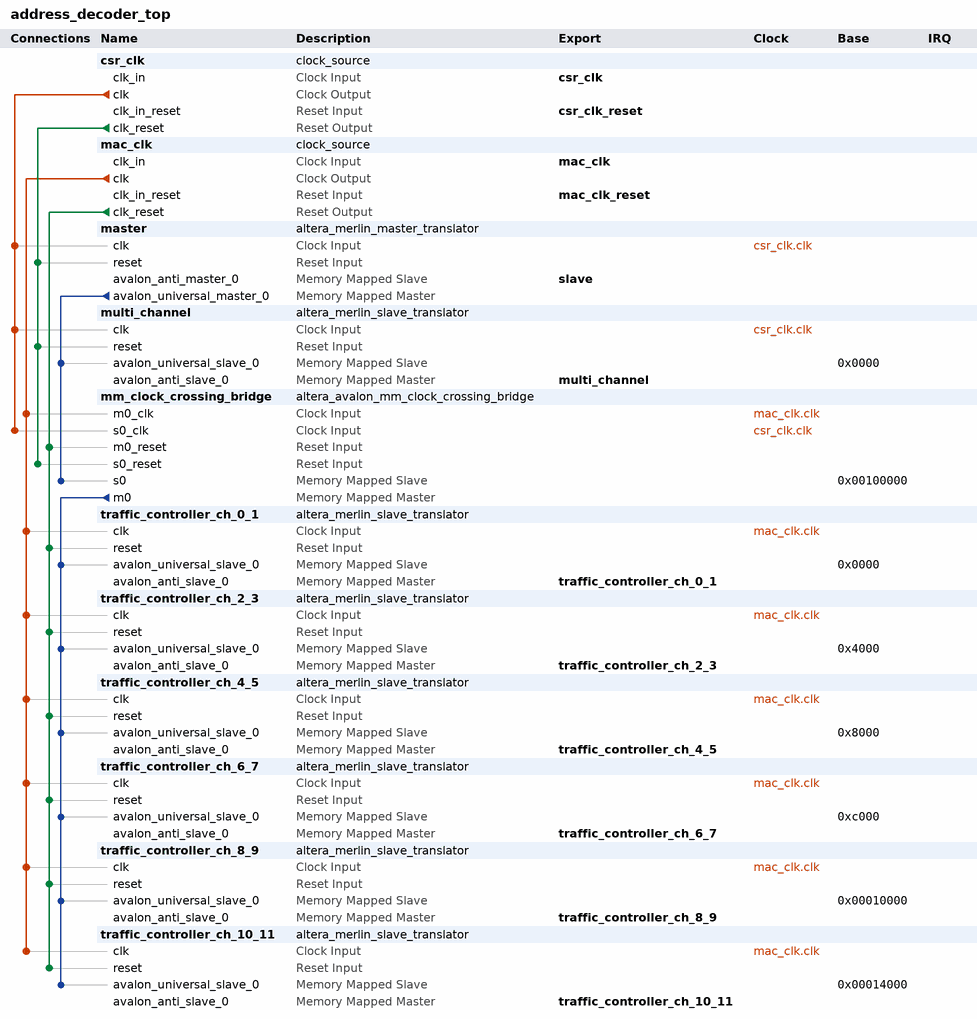
[diagram p0: system contents]
# Platform Designer (Qsys) system address_decoder_top, Cyclone 10 GX 10CX220YF780I5G
# Parameters at their usual value, and those the tool derives, are not listed.
package require -exact qsys 1.0
create_system address_decoder_top
set_project_property DEVICE_FAMILY {Cyclone 10 GX}
set_project_property DEVICE 10CX220YF780I5G

add_component csr_clk ip/address_decoder_top/address_decoder_top_csr_clk.ip clock_source csr_clk 0
load_component csr_clk
set_component_parameter_value clockFrequency 125000000
save_component

add_component mac_clk ip/address_decoder_top/address_decoder_top_mac_clk.ip clock_source mac_clk 
load_component mac_clk
set_component_parameter_value clockFrequency 156250000
save_component

add_component master ip/address_decoder_top/address_decoder_top_master.ip altera_merlin_master_translator master 18.0
load_component master
set_component_parameter_value AV_ADDRESS_W 26
set_component_parameter_value AV_DATA_W 32
set_component_parameter_value AV_BURSTCOUNT_W 3
set_component_parameter_value AV_BYTEENABLE_W 4
set_component_parameter_value UAV_ADDRESS_W 32
set_component_parameter_value UAV_BURSTCOUNT_W 3
set_component_parameter_value AV_READLATENCY 0
set_component_parameter_value AV_WRITE_WAIT 0
set_component_parameter_value AV_READ_WAIT 0
set_component_parameter_value AV_DATA_HOLD 0
set_component_parameter_value AV_SETUP_WAIT 0
set_component_parameter_value USE_READDATA 1
set_component_parameter_value USE_WRITEDATA 1
set_component_parameter_value USE_READ 1
set_component_parameter_value USE_WRITE 1
set_component_parameter_value USE_BEGINBURSTTRANSFER 0
set_component_parameter_value USE_BEGINTRANSFER 0
set_component_parameter_value USE_BYTEENABLE 0
set_component_parameter_value USE_CHIPSELECT 0
set_component_parameter_value USE_ADDRESS 1
set_component_parameter_value USE_BURSTCOUNT 0
set_component_parameter_value USE_DEBUGACCESS 0
set_component_parameter_value USE_CLKEN 0
set_component_parameter_value USE_READDATAVALID 1
set_component_parameter_value USE_WAITREQUEST 1
set_component_parameter_value USE_LOCK 0
set_component_parameter_value USE_READRESPONSE 0
set_component_parameter_value USE_WRITERESPONSE 0
set_component_parameter_value AV_SYMBOLS_PER_WORD 4
set_component_parameter_value AV_ADDRESS_SYMBOLS 1
set_component_parameter_value AV_BURSTCOUNT_SYMBOLS 1
set_component_parameter_value AV_CONSTANT_BURST_BEHAVIOR 0
set_component_parameter_value UAV_CONSTANT_BURST_BEHAVIOR 0
set_component_parameter_value AV_LINEWRAPBURSTS 0
set_component_parameter_value AV_MAX_PENDING_READ_TRANSACTIONS 1
set_component_parameter_value AV_BURSTBOUNDARIES 0
set_component_parameter_value AV_INTERLEAVEBURSTS 0
set_component_parameter_value AV_BITS_PER_SYMBOL 8
set_component_parameter_value AV_ISBIGENDIAN 0
set_component_parameter_value AV_ADDRESSGROUP 0
set_component_parameter_value UAV_ADDRESSGROUP 0
set_component_parameter_value AV_REGISTEROUTGOINGSIGNALS 0
set_component_parameter_value AV_REGISTERINCOMINGSIGNALS 0
set_component_parameter_value AV_ALWAYSBURSTMAXBURST 0
set_component_parameter_value SYNC_RESET 0
set_component_parameter_value WAITREQUEST_ALLOWANCE 0
save_component

add_component multi_channel ip/address_decoder_top/address_decoder_top_multi_channel.ip altera_merlin_slave_translator multi_channel 18.0
load_component multi_channel
set_component_parameter_value AV_ADDRESS_W 20
set_component_parameter_value AV_DATA_W 32
set_component_parameter_value UAV_DATA_W 32
set_component_parameter_value AV_BURSTCOUNT_W 1
set_component_parameter_value AV_BYTEENABLE_W 4
set_component_parameter_value UAV_BYTEENABLE_W 4
set_component_parameter_value UAV_ADDRESS_W 20
set_component_parameter_value UAV_BURSTCOUNT_W 3
set_component_parameter_value AV_READLATENCY 0
set_component_parameter_value AV_SETUP_WAIT 0
set_component_parameter_value AV_WRITE_WAIT 0
set_component_parameter_value AV_READ_WAIT 0
set_component_parameter_value AV_DATA_HOLD 0
set_component_parameter_value AV_TIMING_UNITS 1
set_component_parameter_value USE_READDATA 1
set_component_parameter_value USE_WRITEDATA 1
set_component_parameter_value USE_READ 1
set_component_parameter_value USE_WRITE 1
set_component_parameter_value USE_BEGINBURSTTRANSFER 0
set_component_parameter_value USE_BEGINTRANSFER 0
set_component_parameter_value USE_BYTEENABLE 0
set_component_parameter_value USE_CHIPSELECT 0
set_component_parameter_value USE_ADDRESS 1
set_component_parameter_value USE_BURSTCOUNT 0
set_component_parameter_value USE_READDATAVALID 0
set_component_parameter_value USE_WAITREQUEST 1
set_component_parameter_value USE_WRITEBYTEENABLE 0
set_component_parameter_value USE_LOCK 0
set_component_parameter_value USE_AV_CLKEN 0
set_component_parameter_value USE_UAV_CLKEN 0
set_component_parameter_value USE_OUTPUTENABLE 0
set_component_parameter_value USE_DEBUGACCESS 0
set_component_parameter_value USE_READRESPONSE 0
set_component_parameter_value USE_WRITERESPONSE 0
set_component_parameter_value AV_SYMBOLS_PER_WORD 4
set_component_parameter_value AV_ADDRESS_SYMBOLS 1
set_component_parameter_value AV_BURSTCOUNT_SYMBOLS 1
set_component_parameter_value AV_CONSTANT_BURST_BEHAVIOR 0
set_component_parameter_value UAV_CONSTANT_BURST_BEHAVIOR 0
set_component_parameter_value AV_REQUIRE_UNALIGNED_ADDRESSES 0
set_component_parameter_value AV_LINEWRAPBURSTS 0
set_component_parameter_value AV_MAX_PENDING_READ_TRANSACTIONS 1
set_component_parameter_value AV_MAX_PENDING_WRITE_TRANSACTIONS 0
set_component_parameter_value AV_BURSTBOUNDARIES 0
set_component_parameter_value AV_INTERLEAVEBURSTS 0
set_component_parameter_value AV_BITS_PER_SYMBOL 8
set_component_parameter_value AV_ISBIGENDIAN 0
set_component_parameter_value AV_ADDRESSGROUP 0
set_component_parameter_value UAV_ADDRESSGROUP 0
set_component_parameter_value AV_REGISTEROUTGOINGSIGNALS 0
set_component_parameter_value AV_REGISTERINCOMINGSIGNALS 0
set_component_parameter_value AV_ALWAYSBURSTMAXBURST 0
set_component_parameter_value CHIPSELECT_THROUGH_READLATENCY 0
set_component_parameter_value CLOCK_RATE 125000000
set_component_parameter_value AV_READ_WAIT_CYCLES 0
set_component_parameter_value AV_WRITE_WAIT_CYCLES 0
set_component_parameter_value AV_SETUP_WAIT_CYCLES 0
set_component_parameter_value AV_DATA_HOLD_CYCLES 0
set_component_parameter_value WAITREQUEST_ALLOWANCE 0
save_component

add_component mm_clock_crossing_bridge ip/address_decoder_top/address_decoder_top_mm_clock_crossing_bridge.ip altera_avalon_mm_clock_crossing_bridge mm_clock_crossing_bridge 18.0
load_component mm_clock_crossing_bridge
set_component_parameter_value DATA_WIDTH 32
set_component_parameter_value ADDRESS_WIDTH 20
set_component_parameter_value USE_AUTO_ADDRESS_WIDTH 1
set_component_parameter_value MAX_BURST_SIZE 1
set_component_parameter_value COMMAND_FIFO_DEPTH 4
set_component_parameter_value RESPONSE_FIFO_DEPTH 4
set_component_parameter_value MASTER_SYNC_DEPTH 3
set_component_parameter_value SLAVE_SYNC_DEPTH 3
save_component

add_component traffic_controller_ch_0_1 ip/address_decoder_top/address_decoder_top_traffic_controller_ch_0_1.ip altera_merlin_slave_translator traffic_controller_ch_0_1 18.0
load_component traffic_controller_ch_0_1
set_component_parameter_value AV_ADDRESS_W 14
set_component_parameter_value AV_DATA_W 32
set_component_parameter_value UAV_DATA_W 32
set_component_parameter_value AV_BURSTCOUNT_W 1
set_component_parameter_value AV_BYTEENABLE_W 4
set_component_parameter_value UAV_BYTEENABLE_W 4
set_component_parameter_value UAV_ADDRESS_W 14
set_component_parameter_value UAV_BURSTCOUNT_W 3
set_component_parameter_value AV_READLATENCY 0
set_component_parameter_value AV_SETUP_WAIT 0
set_component_parameter_value AV_WRITE_WAIT 0
set_component_parameter_value AV_READ_WAIT 0
set_component_parameter_value AV_DATA_HOLD 0
set_component_parameter_value AV_TIMING_UNITS 1
set_component_parameter_value USE_READDATA 1
set_component_parameter_value USE_WRITEDATA 1
set_component_parameter_value USE_READ 1
set_component_parameter_value USE_WRITE 1
set_component_parameter_value USE_BEGINBURSTTRANSFER 0
set_component_parameter_value USE_BEGINTRANSFER 0
set_component_parameter_value USE_BYTEENABLE 0
set_component_parameter_value USE_CHIPSELECT 0
set_component_parameter_value USE_ADDRESS 1
set_component_parameter_value USE_BURSTCOUNT 0
set_component_parameter_value USE_READDATAVALID 0
set_component_parameter_value USE_WAITREQUEST 1
set_component_parameter_value USE_WRITEBYTEENABLE 0
set_component_parameter_value USE_LOCK 0
set_component_parameter_value USE_AV_CLKEN 0
set_component_parameter_value USE_UAV_CLKEN 0
set_component_parameter_value USE_OUTPUTENABLE 0
set_component_parameter_value USE_DEBUGACCESS 0
set_component_parameter_value USE_READRESPONSE 0
set_component_parameter_value USE_WRITERESPONSE 0
set_component_parameter_value AV_SYMBOLS_PER_WORD 4
set_component_parameter_value AV_ADDRESS_SYMBOLS 1
set_component_parameter_value AV_BURSTCOUNT_SYMBOLS 1
set_component_parameter_value AV_CONSTANT_BURST_BEHAVIOR 0
set_component_parameter_value UAV_CONSTANT_BURST_BEHAVIOR 0
set_component_parameter_value AV_REQUIRE_UNALIGNED_ADDRESSES 0
set_component_parameter_value AV_LINEWRAPBURSTS 0
set_component_parameter_value AV_MAX_PENDING_READ_TRANSACTIONS 1
set_component_parameter_value AV_MAX_PENDING_WRITE_TRANSACTIONS 0
set_component_parameter_value AV_BURSTBOUNDARIES 0
set_component_parameter_value AV_INTERLEAVEBURSTS 0
set_component_parameter_value AV_BITS_PER_SYMBOL 8
set_component_parameter_value AV_ISBIGENDIAN 0
set_component_parameter_value AV_ADDRESSGROUP 0
set_component_parameter_value UAV_ADDRESSGROUP 0
set_component_parameter_value AV_REGISTEROUTGOINGSIGNALS 0
set_component_parameter_value AV_REGISTERINCOMINGSIGNALS 0
set_component_parameter_value AV_ALWAYSBURSTMAXBURST 0
set_component_parameter_value CHIPSELECT_THROUGH_READLATENCY 0
set_component_parameter_value CLOCK_RATE 156250000
set_component_parameter_value AV_READ_WAIT_CYCLES 0
set_component_parameter_value AV_WRITE_WAIT_CYCLES 0
set_component_parameter_value AV_SETUP_WAIT_CYCLES 0
set_component_parameter_value AV_DATA_HOLD_CYCLES 0
set_component_parameter_value WAITREQUEST_ALLOWANCE 0
save_component

add_component traffic_controller_ch_2_3 ip/address_decoder_top/address_decoder_top_traffic_controller_ch_2_3.ip altera_merlin_slave_translator traffic_controller_ch_2_3 18.0
load_component traffic_controller_ch_2_3
set_component_parameter_value AV_ADDRESS_W 14
set_component_parameter_value AV_DATA_W 32
set_component_parameter_value UAV_DATA_W 32
set_component_parameter_value AV_BURSTCOUNT_W 1
set_component_parameter_value AV_BYTEENABLE_W 4
set_component_parameter_value UAV_BYTEENABLE_W 4
set_component_parameter_value UAV_ADDRESS_W 14
set_component_parameter_value UAV_BURSTCOUNT_W 3
set_component_parameter_value AV_READLATENCY 0
set_component_parameter_value AV_SETUP_WAIT 0
set_component_parameter_value AV_WRITE_WAIT 0
set_component_parameter_value AV_READ_WAIT 0
set_component_parameter_value AV_DATA_HOLD 0
set_component_parameter_value AV_TIMING_UNITS 1
set_component_parameter_value USE_READDATA 1
set_component_parameter_value USE_WRITEDATA 1
set_component_parameter_value USE_READ 1
set_component_parameter_value USE_WRITE 1
set_component_parameter_value USE_BEGINBURSTTRANSFER 0
set_component_parameter_value USE_BEGINTRANSFER 0
set_component_parameter_value USE_BYTEENABLE 0
set_component_parameter_value USE_CHIPSELECT 0
set_component_parameter_value USE_ADDRESS 1
set_component_parameter_value USE_BURSTCOUNT 0
set_component_parameter_value USE_READDATAVALID 0
set_component_parameter_value USE_WAITREQUEST 1
set_component_parameter_value USE_WRITEBYTEENABLE 0
set_component_parameter_value USE_LOCK 0
set_component_parameter_value USE_AV_CLKEN 0
set_component_parameter_value USE_UAV_CLKEN 0
set_component_parameter_value USE_OUTPUTENABLE 0
set_component_parameter_value USE_DEBUGACCESS 0
set_component_parameter_value USE_READRESPONSE 0
set_component_parameter_value USE_WRITERESPONSE 0
set_component_parameter_value AV_SYMBOLS_PER_WORD 4
set_component_parameter_value AV_ADDRESS_SYMBOLS 1
set_component_parameter_value AV_BURSTCOUNT_SYMBOLS 1
set_component_parameter_value AV_CONSTANT_BURST_BEHAVIOR 0
set_component_parameter_value UAV_CONSTANT_BURST_BEHAVIOR 0
set_component_parameter_value AV_REQUIRE_UNALIGNED_ADDRESSES 0
set_component_parameter_value AV_LINEWRAPBURSTS 0
set_component_parameter_value AV_MAX_PENDING_READ_TRANSACTIONS 1
set_component_parameter_value AV_MAX_PENDING_WRITE_TRANSACTIONS 0
set_component_parameter_value AV_BURSTBOUNDARIES 0
set_component_parameter_value AV_INTERLEAVEBURSTS 0
set_component_parameter_value AV_BITS_PER_SYMBOL 8
set_component_parameter_value AV_ISBIGENDIAN 0
set_component_parameter_value AV_ADDRESSGROUP 0
set_component_parameter_value UAV_ADDRESSGROUP 0
set_component_parameter_value AV_REGISTEROUTGOINGSIGNALS 0
set_component_parameter_value AV_REGISTERINCOMINGSIGNALS 0
set_component_parameter_value AV_ALWAYSBURSTMAXBURST 0
set_component_parameter_value CHIPSELECT_THROUGH_READLATENCY 0
set_component_parameter_value CLOCK_RATE 156250000
set_component_parameter_value AV_READ_WAIT_CYCLES 0
set_component_parameter_value AV_WRITE_WAIT_CYCLES 0
set_component_parameter_value AV_SETUP_WAIT_CYCLES 0
set_component_parameter_value AV_DATA_HOLD_CYCLES 0
set_component_parameter_value WAITREQUEST_ALLOWANCE 0
save_component

add_component traffic_controller_ch_4_5 ip/address_decoder_top/address_decoder_top_traffic_controller_ch_4_5.ip altera_merlin_slave_translator traffic_controller_ch_4_5 18.0
load_component traffic_controller_ch_4_5
set_component_parameter_value AV_ADDRESS_W 14
set_component_parameter_value AV_DATA_W 32
set_component_parameter_value UAV_DATA_W 32
set_component_parameter_value AV_BURSTCOUNT_W 1
set_component_parameter_value AV_BYTEENABLE_W 4
set_component_parameter_value UAV_BYTEENABLE_W 4
set_component_parameter_value UAV_ADDRESS_W 14
set_component_parameter_value UAV_BURSTCOUNT_W 3
set_component_parameter_value AV_READLATENCY 0
set_component_parameter_value AV_SETUP_WAIT 0
set_component_parameter_value AV_WRITE_WAIT 0
set_component_parameter_value AV_READ_WAIT 0
set_component_parameter_value AV_DATA_HOLD 0
set_component_parameter_value AV_TIMING_UNITS 1
set_component_parameter_value USE_READDATA 1
set_component_parameter_value USE_WRITEDATA 1
set_component_parameter_value USE_READ 1
set_component_parameter_value USE_WRITE 1
set_component_parameter_value USE_BEGINBURSTTRANSFER 0
set_component_parameter_value USE_BEGINTRANSFER 0
set_component_parameter_value USE_BYTEENABLE 0
set_component_parameter_value USE_CHIPSELECT 0
set_component_parameter_value USE_ADDRESS 1
set_component_parameter_value USE_BURSTCOUNT 0
set_component_parameter_value USE_READDATAVALID 0
set_component_parameter_value USE_WAITREQUEST 1
set_component_parameter_value USE_WRITEBYTEENABLE 0
set_component_parameter_value USE_LOCK 0
set_component_parameter_value USE_AV_CLKEN 0
set_component_parameter_value USE_UAV_CLKEN 0
set_component_parameter_value USE_OUTPUTENABLE 0
set_component_parameter_value USE_DEBUGACCESS 0
set_component_parameter_value USE_READRESPONSE 0
set_component_parameter_value USE_WRITERESPONSE 0
set_component_parameter_value AV_SYMBOLS_PER_WORD 4
set_component_parameter_value AV_ADDRESS_SYMBOLS 1
set_component_parameter_value AV_BURSTCOUNT_SYMBOLS 1
set_component_parameter_value AV_CONSTANT_BURST_BEHAVIOR 0
set_component_parameter_value UAV_CONSTANT_BURST_BEHAVIOR 0
set_component_parameter_value AV_REQUIRE_UNALIGNED_ADDRESSES 0
set_component_parameter_value AV_LINEWRAPBURSTS 0
set_component_parameter_value AV_MAX_PENDING_READ_TRANSACTIONS 1
set_component_parameter_value AV_MAX_PENDING_WRITE_TRANSACTIONS 0
set_component_parameter_value AV_BURSTBOUNDARIES 0
set_component_parameter_value AV_INTERLEAVEBURSTS 0
set_component_parameter_value AV_BITS_PER_SYMBOL 8
set_component_parameter_value AV_ISBIGENDIAN 0
set_component_parameter_value AV_ADDRESSGROUP 0
set_component_parameter_value UAV_ADDRESSGROUP 0
set_component_parameter_value AV_REGISTEROUTGOINGSIGNALS 0
set_component_parameter_value AV_REGISTERINCOMINGSIGNALS 0
set_component_parameter_value AV_ALWAYSBURSTMAXBURST 0
set_component_parameter_value CHIPSELECT_THROUGH_READLATENCY 0
set_component_parameter_value CLOCK_RATE 156250000
set_component_parameter_value AV_READ_WAIT_CYCLES 0
set_component_parameter_value AV_WRITE_WAIT_CYCLES 0
set_component_parameter_value AV_SETUP_WAIT_CYCLES 0
set_component_parameter_value AV_DATA_HOLD_CYCLES 0
set_component_parameter_value WAITREQUEST_ALLOWANCE 0
save_component

add_component traffic_controller_ch_6_7 ip/address_decoder_top/address_decoder_top_traffic_controller_ch_6_7.ip altera_merlin_slave_translator traffic_controller_ch_6_7 18.0
load_component traffic_controller_ch_6_7
set_component_parameter_value AV_ADDRESS_W 14
set_component_parameter_value AV_DATA_W 32
set_component_parameter_value UAV_DATA_W 32
set_component_parameter_value AV_BURSTCOUNT_W 1
set_component_parameter_value AV_BYTEENABLE_W 4
set_component_parameter_value UAV_BYTEENABLE_W 4
set_component_parameter_value UAV_ADDRESS_W 14
set_component_parameter_value UAV_BURSTCOUNT_W 3
set_component_parameter_value AV_READLATENCY 0
set_component_parameter_value AV_SETUP_WAIT 0
set_component_parameter_value AV_WRITE_WAIT 0
set_component_parameter_value AV_READ_WAIT 0
set_component_parameter_value AV_DATA_HOLD 0
set_component_parameter_value AV_TIMING_UNITS 1
set_component_parameter_value USE_READDATA 1
set_component_parameter_value USE_WRITEDATA 1
set_component_parameter_value USE_READ 1
set_component_parameter_value USE_WRITE 1
set_component_parameter_value USE_BEGINBURSTTRANSFER 0
set_component_parameter_value USE_BEGINTRANSFER 0
set_component_parameter_value USE_BYTEENABLE 0
set_component_parameter_value USE_CHIPSELECT 0
set_component_parameter_value USE_ADDRESS 1
set_component_parameter_value USE_BURSTCOUNT 0
set_component_parameter_value USE_READDATAVALID 0
set_component_parameter_value USE_WAITREQUEST 1
set_component_parameter_value USE_WRITEBYTEENABLE 0
set_component_parameter_value USE_LOCK 0
set_component_parameter_value USE_AV_CLKEN 0
set_component_parameter_value USE_UAV_CLKEN 0
set_component_parameter_value USE_OUTPUTENABLE 0
set_component_parameter_value USE_DEBUGACCESS 0
set_component_parameter_value USE_READRESPONSE 0
set_component_parameter_value USE_WRITERESPONSE 0
set_component_parameter_value AV_SYMBOLS_PER_WORD 4
set_component_parameter_value AV_ADDRESS_SYMBOLS 1
set_component_parameter_value AV_BURSTCOUNT_SYMBOLS 1
set_component_parameter_value AV_CONSTANT_BURST_BEHAVIOR 0
set_component_parameter_value UAV_CONSTANT_BURST_BEHAVIOR 0
set_component_parameter_value AV_REQUIRE_UNALIGNED_ADDRESSES 0
set_component_parameter_value AV_LINEWRAPBURSTS 0
set_component_parameter_value AV_MAX_PENDING_READ_TRANSACTIONS 1
set_component_parameter_value AV_MAX_PENDING_WRITE_TRANSACTIONS 0
set_component_parameter_value AV_BURSTBOUNDARIES 0
set_component_parameter_value AV_INTERLEAVEBURSTS 0
set_component_parameter_value AV_BITS_PER_SYMBOL 8
set_component_parameter_value AV_ISBIGENDIAN 0
set_component_parameter_value AV_ADDRESSGROUP 0
set_component_parameter_value UAV_ADDRESSGROUP 0
set_component_parameter_value AV_REGISTEROUTGOINGSIGNALS 0
set_component_parameter_value AV_REGISTERINCOMINGSIGNALS 0
set_component_parameter_value AV_ALWAYSBURSTMAXBURST 0
set_component_parameter_value CHIPSELECT_THROUGH_READLATENCY 0
set_component_parameter_value CLOCK_RATE 156250000
set_component_parameter_value AV_READ_WAIT_CYCLES 0
set_component_parameter_value AV_WRITE_WAIT_CYCLES 0
set_component_parameter_value AV_SETUP_WAIT_CYCLES 0
set_component_parameter_value AV_DATA_HOLD_CYCLES 0
set_component_parameter_value WAITREQUEST_ALLOWANCE 0
save_component

add_component traffic_controller_ch_8_9 ip/address_decoder_top/address_decoder_top_traffic_controller_ch_8_9.ip altera_merlin_slave_translator traffic_controller_ch_8_9 18.0
load_component traffic_controller_ch_8_9
set_component_parameter_value AV_ADDRESS_W 14
set_component_parameter_value AV_DATA_W 32
set_component_parameter_value UAV_DATA_W 32
set_component_parameter_value AV_BURSTCOUNT_W 1
set_component_parameter_value AV_BYTEENABLE_W 4
set_component_parameter_value UAV_BYTEENABLE_W 4
set_component_parameter_value UAV_ADDRESS_W 14
set_component_parameter_value UAV_BURSTCOUNT_W 3
set_component_parameter_value AV_READLATENCY 0
set_component_parameter_value AV_SETUP_WAIT 0
set_component_parameter_value AV_WRITE_WAIT 0
set_component_parameter_value AV_READ_WAIT 0
set_component_parameter_value AV_DATA_HOLD 0
set_component_parameter_value AV_TIMING_UNITS 1
set_component_parameter_value USE_READDATA 1
set_component_parameter_value USE_WRITEDATA 1
set_component_parameter_value USE_READ 1
set_component_parameter_value USE_WRITE 1
set_component_parameter_value USE_BEGINBURSTTRANSFER 0
set_component_parameter_value USE_BEGINTRANSFER 0
set_component_parameter_value USE_BYTEENABLE 0
set_component_parameter_value USE_CHIPSELECT 0
set_component_parameter_value USE_ADDRESS 1
set_component_parameter_value USE_BURSTCOUNT 0
set_component_parameter_value USE_READDATAVALID 0
set_component_parameter_value USE_WAITREQUEST 1
set_component_parameter_value USE_WRITEBYTEENABLE 0
set_component_parameter_value USE_LOCK 0
set_component_parameter_value USE_AV_CLKEN 0
set_component_parameter_value USE_UAV_CLKEN 0
set_component_parameter_value USE_OUTPUTENABLE 0
set_component_parameter_value USE_DEBUGACCESS 0
set_component_parameter_value USE_READRESPONSE 0
set_component_parameter_value USE_WRITERESPONSE 0
set_component_parameter_value AV_SYMBOLS_PER_WORD 4
set_component_parameter_value AV_ADDRESS_SYMBOLS 1
set_component_parameter_value AV_BURSTCOUNT_SYMBOLS 1
set_component_parameter_value AV_CONSTANT_BURST_BEHAVIOR 0
set_component_parameter_value UAV_CONSTANT_BURST_BEHAVIOR 0
set_component_parameter_value AV_REQUIRE_UNALIGNED_ADDRESSES 0
set_component_parameter_value AV_LINEWRAPBURSTS 0
set_component_parameter_value AV_MAX_PENDING_READ_TRANSACTIONS 1
set_component_parameter_value AV_MAX_PENDING_WRITE_TRANSACTIONS 0
set_component_parameter_value AV_BURSTBOUNDARIES 0
set_component_parameter_value AV_INTERLEAVEBURSTS 0
set_component_parameter_value AV_BITS_PER_SYMBOL 8
set_component_parameter_value AV_ISBIGENDIAN 0
set_component_parameter_value AV_ADDRESSGROUP 0
set_component_parameter_value UAV_ADDRESSGROUP 0
set_component_parameter_value AV_REGISTEROUTGOINGSIGNALS 0
set_component_parameter_value AV_REGISTERINCOMINGSIGNALS 0
set_component_parameter_value AV_ALWAYSBURSTMAXBURST 0
set_component_parameter_value CHIPSELECT_THROUGH_READLATENCY 0
set_component_parameter_value CLOCK_RATE 156250000
set_component_parameter_value AV_READ_WAIT_CYCLES 0
set_component_parameter_value AV_WRITE_WAIT_CYCLES 0
set_component_parameter_value AV_SETUP_WAIT_CYCLES 0
set_component_parameter_value AV_DATA_HOLD_CYCLES 0
set_component_parameter_value WAITREQUEST_ALLOWANCE 0
save_component

add_component traffic_controller_ch_10_11 ip/address_decoder_top/address_decoder_top_traffic_controller_ch_10_11.ip altera_merlin_slave_translator traffic_controller_ch_10_11 18.0
load_component traffic_controller_ch_10_11
set_component_parameter_value AV_ADDRESS_W 14
set_component_parameter_value AV_DATA_W 32
set_component_parameter_value UAV_DATA_W 32
set_component_parameter_value AV_BURSTCOUNT_W 1
set_component_parameter_value AV_BYTEENABLE_W 4
set_component_parameter_value UAV_BYTEENABLE_W 4
set_component_parameter_value UAV_ADDRESS_W 14
set_component_parameter_value UAV_BURSTCOUNT_W 3
set_component_parameter_value AV_READLATENCY 0
set_component_parameter_value AV_SETUP_WAIT 0
set_component_parameter_value AV_WRITE_WAIT 0
set_component_parameter_value AV_READ_WAIT 0
set_component_parameter_value AV_DATA_HOLD 0
set_component_parameter_value AV_TIMING_UNITS 1
set_component_parameter_value USE_READDATA 1
set_component_parameter_value USE_WRITEDATA 1
set_component_parameter_value USE_READ 1
set_component_parameter_value USE_WRITE 1
set_component_parameter_value USE_BEGINBURSTTRANSFER 0
set_component_parameter_value USE_BEGINTRANSFER 0
set_component_parameter_value USE_BYTEENABLE 0
set_component_parameter_value USE_CHIPSELECT 0
set_component_parameter_value USE_ADDRESS 1
set_component_parameter_value USE_BURSTCOUNT 0
set_component_parameter_value USE_READDATAVALID 0
set_component_parameter_value USE_WAITREQUEST 1
set_component_parameter_value USE_WRITEBYTEENABLE 0
set_component_parameter_value USE_LOCK 0
set_component_parameter_value USE_AV_CLKEN 0
set_component_parameter_value USE_UAV_CLKEN 0
set_component_parameter_value USE_OUTPUTENABLE 0
set_component_parameter_value USE_DEBUGACCESS 0
set_component_parameter_value USE_READRESPONSE 0
set_component_parameter_value USE_WRITERESPONSE 0
set_component_parameter_value AV_SYMBOLS_PER_WORD 4
set_component_parameter_value AV_ADDRESS_SYMBOLS 1
set_component_parameter_value AV_BURSTCOUNT_SYMBOLS 1
set_component_parameter_value AV_CONSTANT_BURST_BEHAVIOR 0
set_component_parameter_value UAV_CONSTANT_BURST_BEHAVIOR 0
set_component_parameter_value AV_REQUIRE_UNALIGNED_ADDRESSES 0
set_component_parameter_value AV_LINEWRAPBURSTS 0
set_component_parameter_value AV_MAX_PENDING_READ_TRANSACTIONS 1
set_component_parameter_value AV_MAX_PENDING_WRITE_TRANSACTIONS 0
set_component_parameter_value AV_BURSTBOUNDARIES 0
set_component_parameter_value AV_INTERLEAVEBURSTS 0
set_component_parameter_value AV_BITS_PER_SYMBOL 8
set_component_parameter_value AV_ISBIGENDIAN 0
set_component_parameter_value AV_ADDRESSGROUP 0
set_component_parameter_value UAV_ADDRESSGROUP 0
set_component_parameter_value AV_REGISTEROUTGOINGSIGNALS 0
set_component_parameter_value AV_REGISTERINCOMINGSIGNALS 0
set_component_parameter_value AV_ALWAYSBURSTMAXBURST 0
set_component_parameter_value CHIPSELECT_THROUGH_READLATENCY 0
set_component_parameter_value CLOCK_RATE 156250000
set_component_parameter_value AV_READ_WAIT_CYCLES 0
set_component_parameter_value AV_WRITE_WAIT_CYCLES 0
set_component_parameter_value AV_SETUP_WAIT_CYCLES 0
set_component_parameter_value AV_DATA_HOLD_CYCLES 0
set_component_parameter_value WAITREQUEST_ALLOWANCE 0
save_component

# connections
add_connection csr_clk.clk master.clk clock
add_connection csr_clk.clk mm_clock_crossing_bridge.s0_clk clock
add_connection csr_clk.clk multi_channel.clk clock
add_connection mac_clk.clk mm_clock_crossing_bridge.m0_clk clock
add_connection mac_clk.clk traffic_controller_ch_0_1.clk clock
add_connection mac_clk.clk traffic_controller_ch_2_3.clk clock
add_connection mac_clk.clk traffic_controller_ch_4_5.clk clock
add_connection mac_clk.clk traffic_controller_ch_6_7.clk clock
add_connection mac_clk.clk traffic_controller_ch_8_9.clk clock
add_connection mac_clk.clk traffic_controller_ch_10_11.clk clock
add_connection csr_clk.clk_reset master.reset reset
add_connection csr_clk.clk_reset mm_clock_crossing_bridge.s0_reset reset
add_connection csr_clk.clk_reset multi_channel.reset reset
add_connection mac_clk.clk_reset mm_clock_crossing_bridge.m0_reset reset
add_connection mac_clk.clk_reset traffic_controller_ch_0_1.reset reset
add_connection mac_clk.clk_reset traffic_controller_ch_2_3.reset reset
add_connection mac_clk.clk_reset traffic_controller_ch_4_5.reset reset
add_connection mac_clk.clk_reset traffic_controller_ch_6_7.reset reset
add_connection mac_clk.clk_reset traffic_controller_ch_8_9.reset reset
add_connection mac_clk.clk_reset traffic_controller_ch_10_11.reset reset
add_connection master.avalon_universal_master_0 mm_clock_crossing_bridge.s0 avalon
set_connection_parameter_value master.avalon_universal_master_0/mm_clock_crossing_bridge.s0 baseAddress 0x00100000
add_connection master.avalon_universal_master_0 multi_channel.avalon_universal_slave_0 avalon
set_connection_parameter_value master.avalon_universal_master_0/multi_channel.avalon_universal_slave_0 baseAddress 0x0000
add_connection mm_clock_crossing_bridge.m0 traffic_controller_ch_0_1.avalon_universal_slave_0 avalon
set_connection_parameter_value mm_clock_crossing_bridge.m0/traffic_controller_ch_0_1.avalon_universal_slave_0 baseAddress 0x0000
add_connection mm_clock_crossing_bridge.m0 traffic_controller_ch_2_3.avalon_universal_slave_0 avalon
set_connection_parameter_value mm_clock_crossing_bridge.m0/traffic_controller_ch_2_3.avalon_universal_slave_0 baseAddress 0x4000
add_connection mm_clock_crossing_bridge.m0 traffic_controller_ch_4_5.avalon_universal_slave_0 avalon
set_connection_parameter_value mm_clock_crossing_bridge.m0/traffic_controller_ch_4_5.avalon_universal_slave_0 baseAddress 0x8000
add_connection mm_clock_crossing_bridge.m0 traffic_controller_ch_6_7.avalon_universal_slave_0 avalon
set_connection_parameter_value mm_clock_crossing_bridge.m0/traffic_controller_ch_6_7.avalon_universal_slave_0 baseAddress 0xc000
add_connection mm_clock_crossing_bridge.m0 traffic_controller_ch_8_9.avalon_universal_slave_0 avalon
set_connection_parameter_value mm_clock_crossing_bridge.m0/traffic_controller_ch_8_9.avalon_universal_slave_0 baseAddress 0x00010000
add_connection mm_clock_crossing_bridge.m0 traffic_controller_ch_10_11.avalon_universal_slave_0 avalon
set_connection_parameter_value mm_clock_crossing_bridge.m0/traffic_controller_ch_10_11.avalon_universal_slave_0 baseAddress 0x00014000

# exported interfaces
add_interface csr_clk clock sink
set_interface_property csr_clk EXPORT_OF csr_clk.clk_in
add_interface csr_clk_reset reset sink
set_interface_property csr_clk_reset EXPORT_OF csr_clk.clk_in_reset
add_interface mac_clk clock sink
set_interface_property mac_clk EXPORT_OF mac_clk.clk_in
add_interface mac_clk_reset reset sink
set_interface_property mac_clk_reset EXPORT_OF mac_clk.clk_in_reset
add_interface multi_channel avalon master
set_interface_property multi_channel EXPORT_OF multi_channel.avalon_anti_slave_0
add_interface slave avalon slave
set_interface_property slave EXPORT_OF master.avalon_anti_master_0
add_interface traffic_controller_ch_0_1 avalon master
set_interface_property traffic_controller_ch_0_1 EXPORT_OF traffic_controller_ch_0_1.avalon_anti_slave_0
add_interface traffic_controller_ch_10_11 avalon master
set_interface_property traffic_controller_ch_10_11 EXPORT_OF traffic_controller_ch_10_11.avalon_anti_slave_0
add_interface traffic_controller_ch_2_3 avalon master
set_interface_property traffic_controller_ch_2_3 EXPORT_OF traffic_controller_ch_2_3.avalon_anti_slave_0
add_interface traffic_controller_ch_4_5 avalon master
set_interface_property traffic_controller_ch_4_5 EXPORT_OF traffic_controller_ch_4_5.avalon_anti_slave_0
add_interface traffic_controller_ch_6_7 avalon master
set_interface_property traffic_controller_ch_6_7 EXPORT_OF traffic_controller_ch_6_7.avalon_anti_slave_0
add_interface traffic_controller_ch_8_9 avalon master
set_interface_property traffic_controller_ch_8_9 EXPORT_OF traffic_controller_ch_8_9.avalon_anti_slave_0

set_interconnect_requirement {$system} qsys_mm.clockCrossingAdapter HANDSHAKE
set_interconnect_requirement {$system} qsys_mm.maxAdditionalLatency 1

save_system address_decoder_top.qsys
